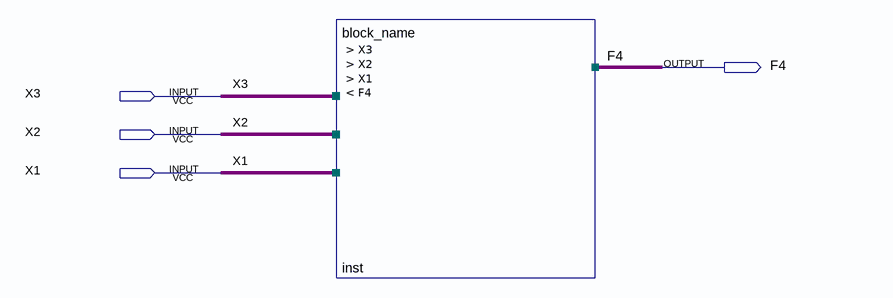
[diagram p0: schematic sheet]
// Quartus schematic DavydchukArtem_IO41_lab1.bdf as structural Verilog: 1 symbols, 4 pins
module DavydchukArtem_IO41_lab1 (
  input  X3,
  input  X2,
  input  X1,
  output F4
);

  block_name inst (.X3(X3), .X2(X2), .X1(X1), .F4(F4));
endmodule
